# EAGLE design arducard (EAGLE 6.5.0)
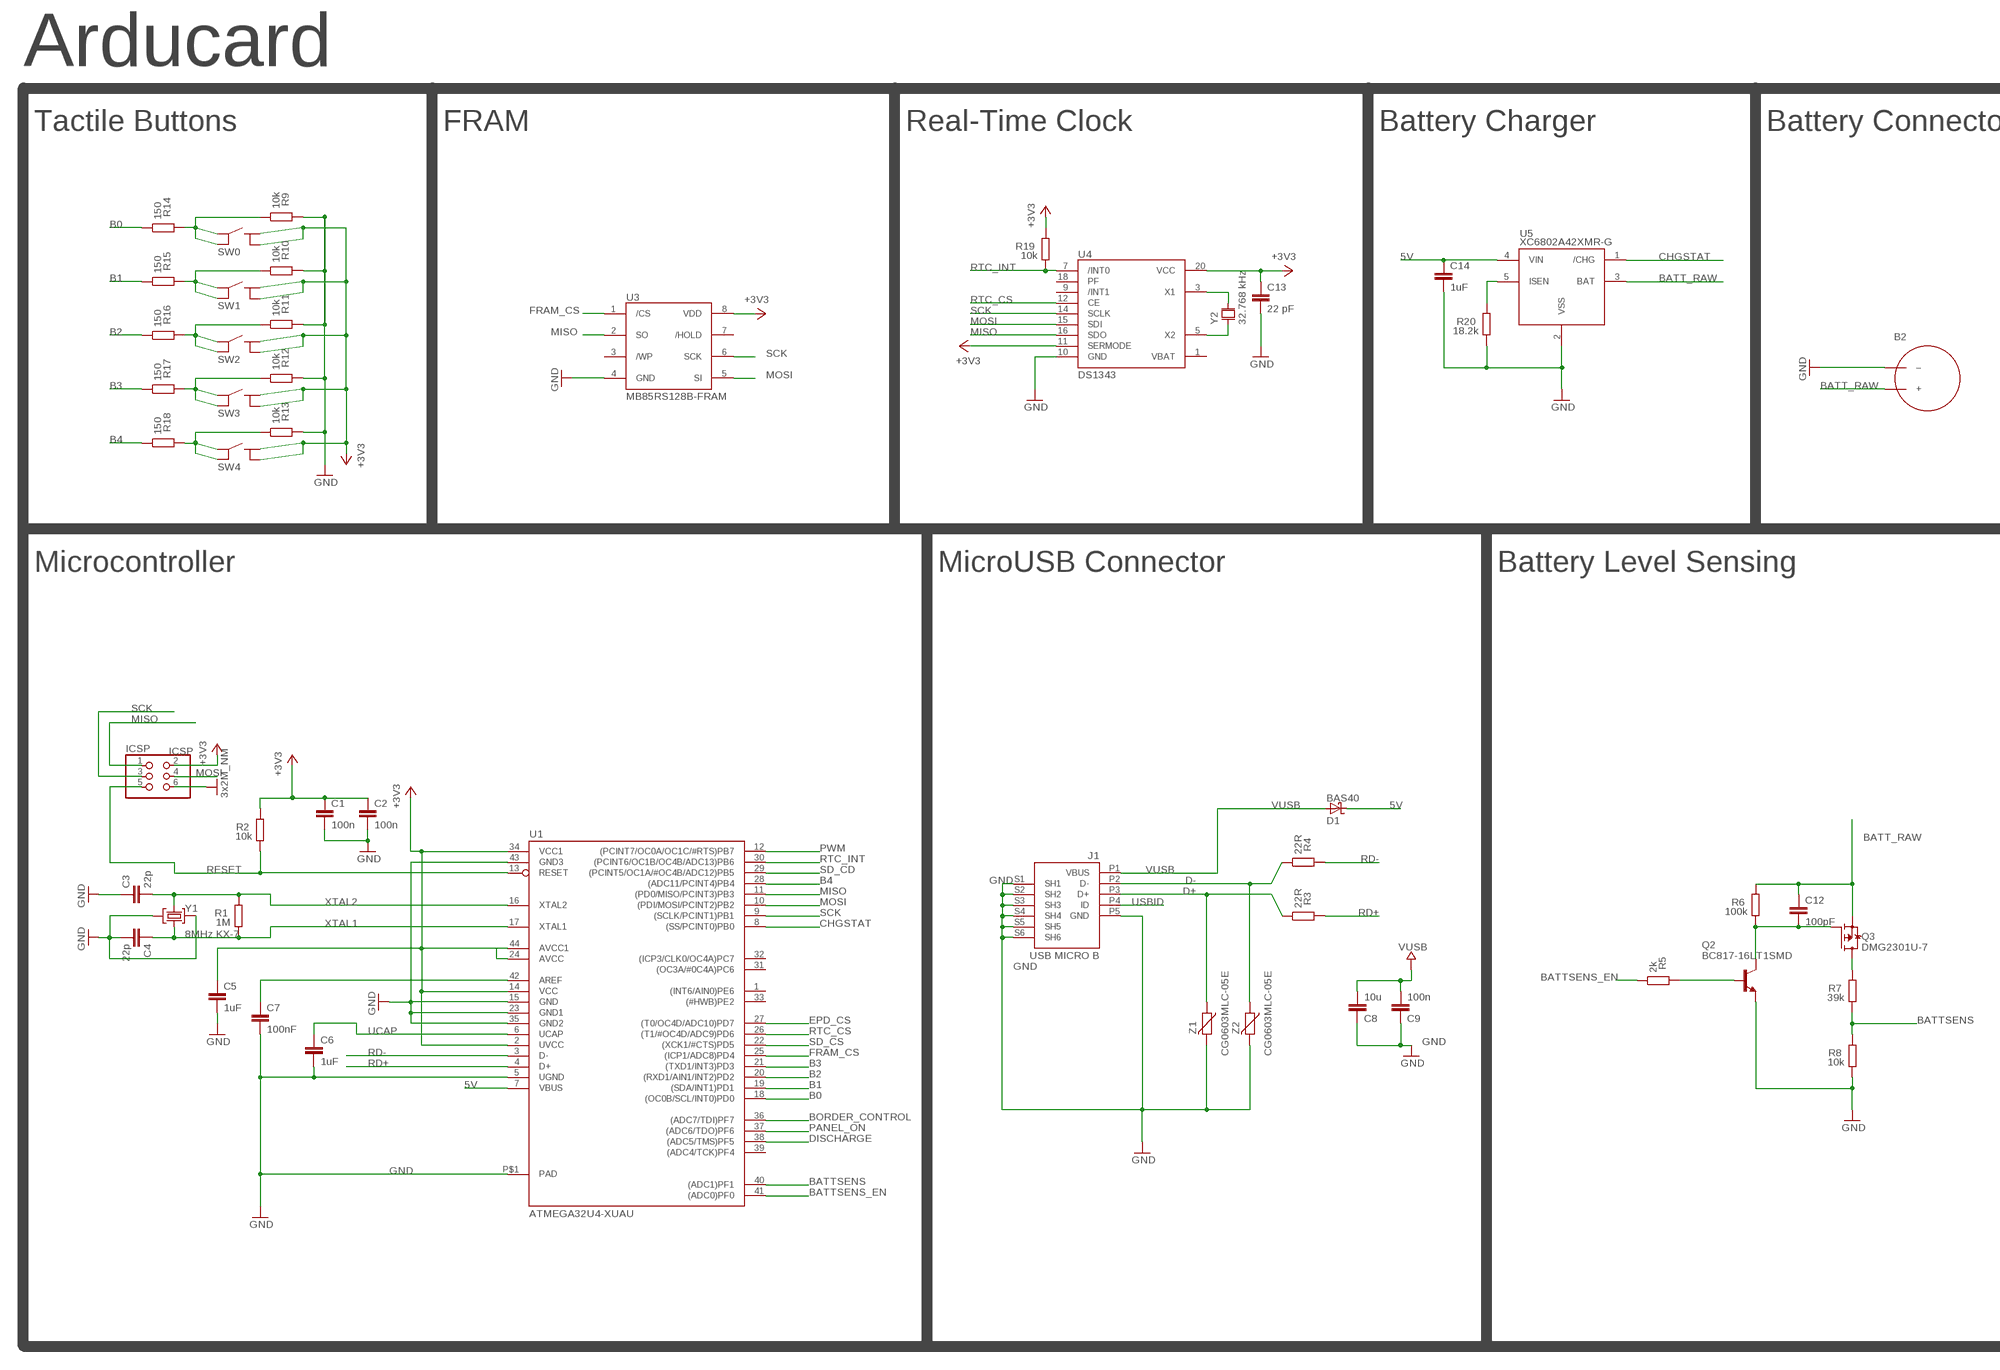
[diagram p0: schematic, sheet 1, part 1 of 2]
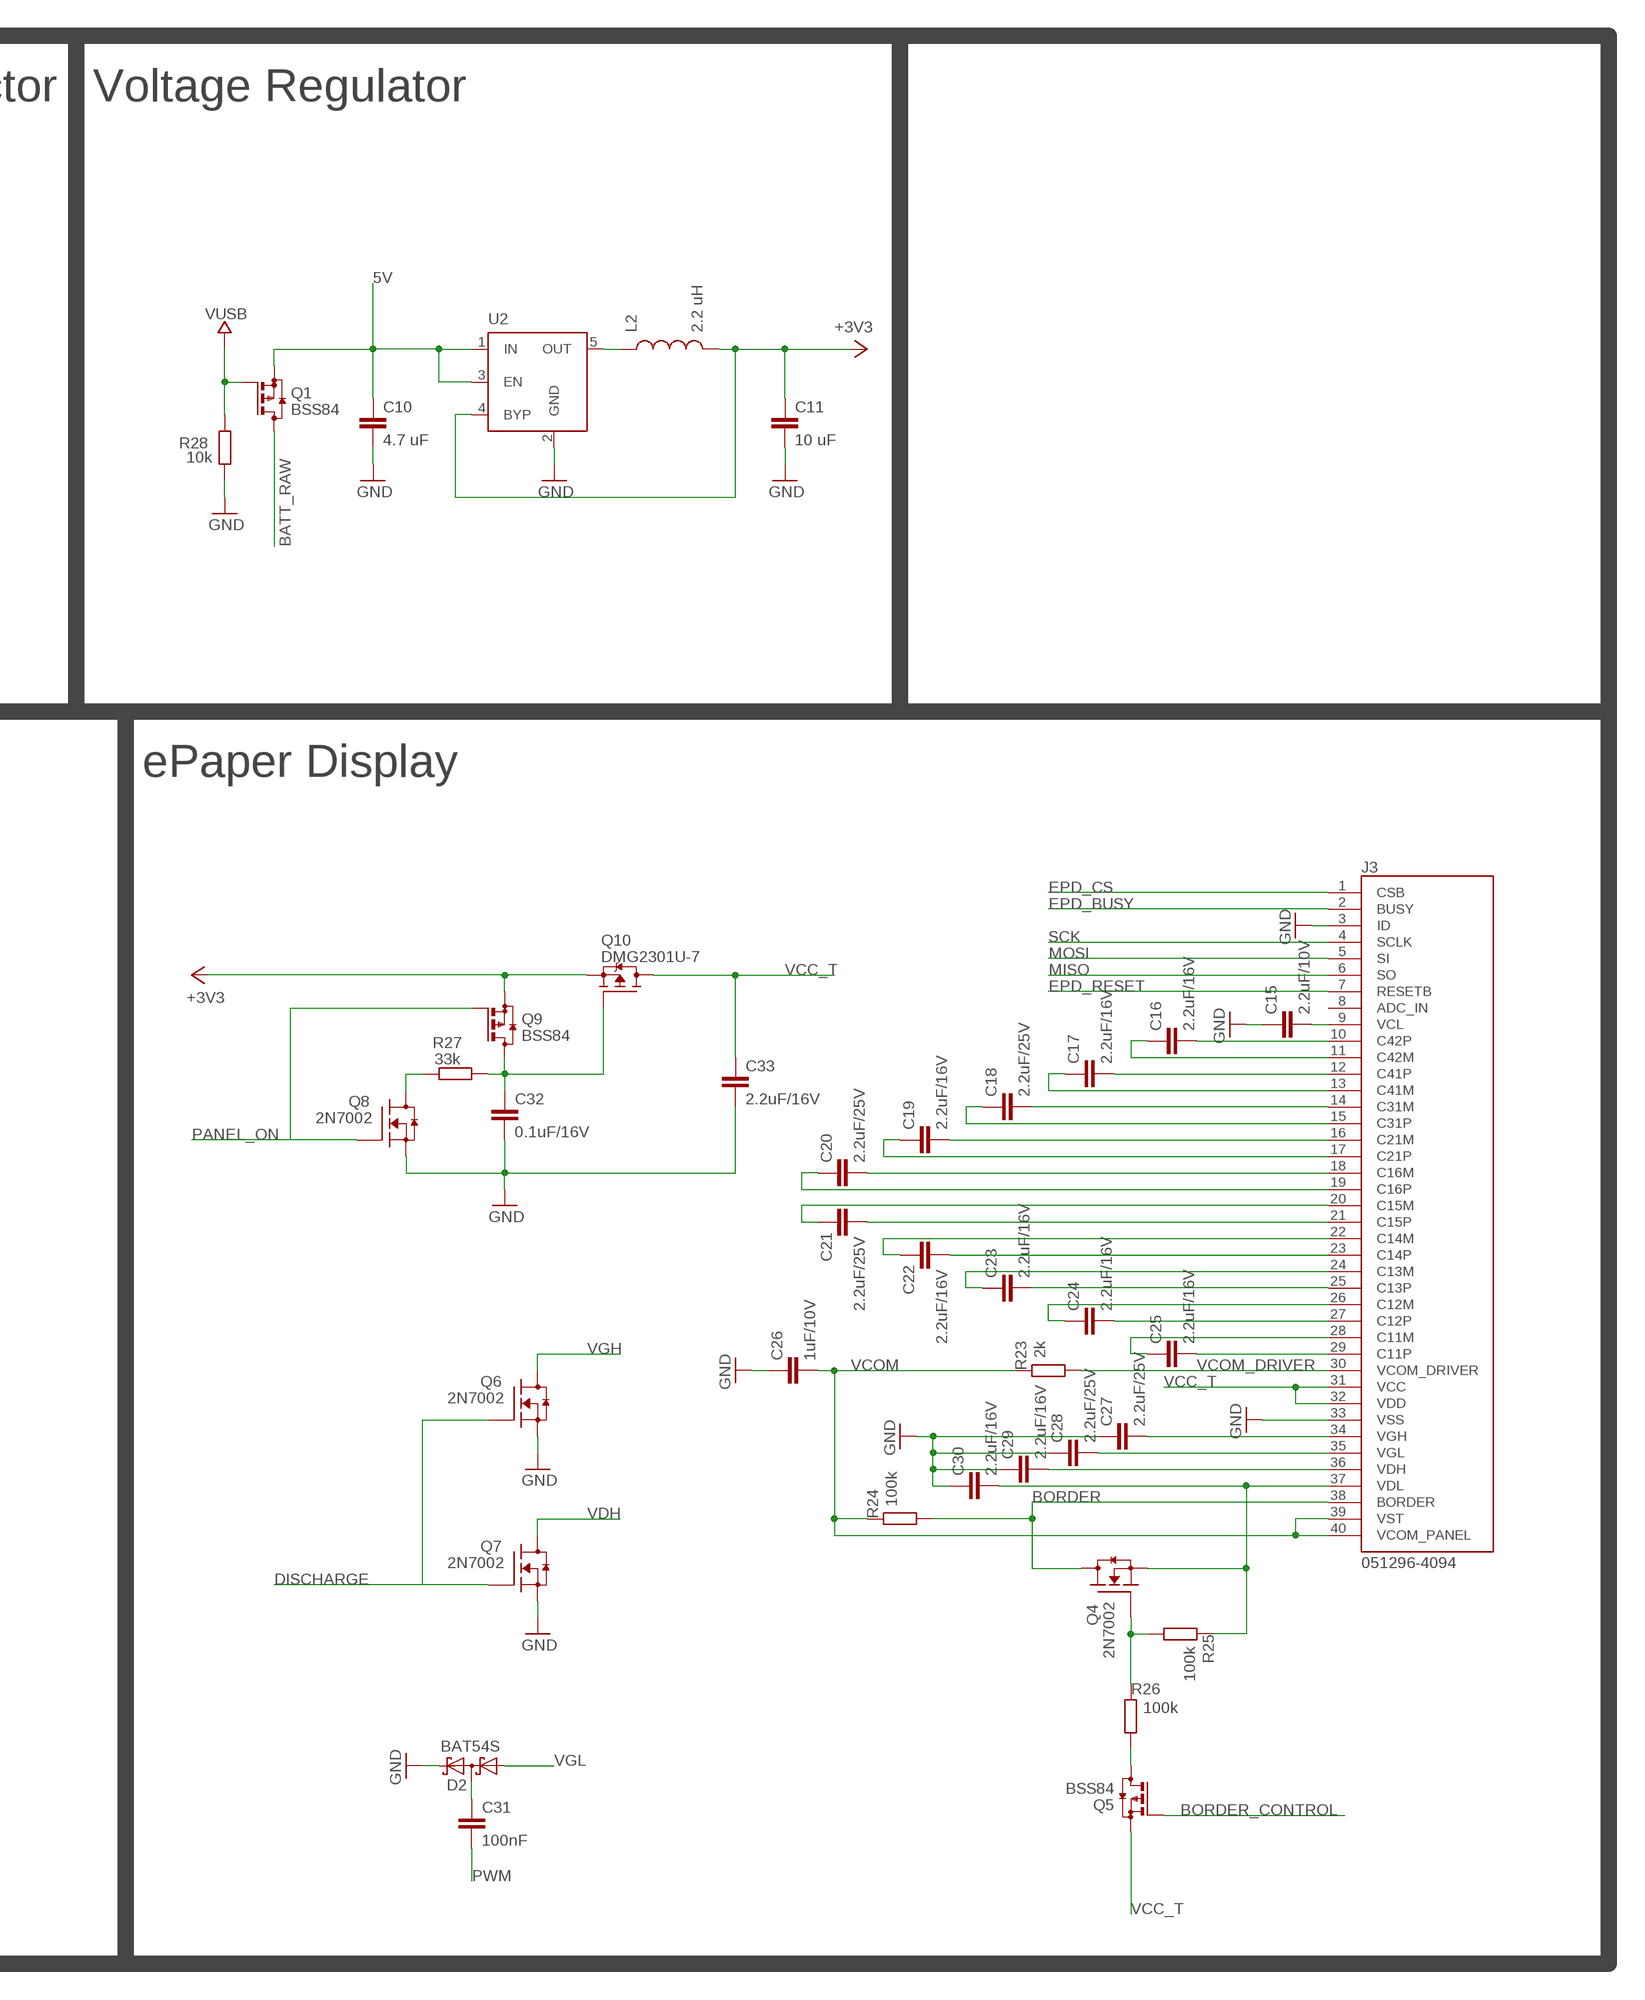
[diagram p1: schematic, sheet 1, part 2 of 2]

## Parts
B2  LIR2016  [BK-5067]
C1  100n  C-EUC0603  [C0603-ROUND]
C2  100n  C-EUC0603  [C0603-ROUND]
C3  22p  C-EUC0603  [C0603-ROUND]
C4  22p  C-EUC0603  [C0603-ROUND]
C5  1uF  C-EUC0603  [C0603-ROUND]
C6  1uF  C-EUC0603  [C0603-ROUND]
C7  100nF  C-EUC0603  [C0603-ROUND]
C8  10u  C-EUC0603  [C0603-ROUND]
C9  100n  C-EUC0603  [C0603-ROUND]
C10  4.7 uF  C-EUC0603  [C0603-ROUND]
C11  10 uF  C-EUC0603  [C0603-ROUND]
C12  100pF  C-EUC0603  [C0603-ROUND]
C13  22 pF  C-EUC0603  [C0603-ROUND]
C14  1uF  C-EUC0603  [C0603-ROUND]
C15  2.2uF/10V  C-EUC0603  [C0603-ROUND]
C16  2.2uF/16V  C-EUC0603  [C0603-ROUND]
C17  2.2uF/16V  C-EUC0603  [C0603-ROUND]
C18  2.2uF/25V  C-EUC0603  [C0603-ROUND]
C19  2.2uF/16V  C-EUC0603  [C0603-ROUND]
C20  2.2uF/25V  C-EUC0603  [C0603-ROUND]
C21  2.2uF/25V  C-EUC0603  [C0603-ROUND]
C22  2.2uF/16V  C-EUC0603  [C0603-ROUND]
C23  2.2uF/16V  C-EUC0603  [C0603-ROUND]
C24  2.2uF/16V  C-EUC0603  [C0603-ROUND]
C25  2.2uF/16V  C-EUC0603  [C0603-ROUND]
C26  1uF/10V  C-EUC0603  [C0603-ROUND]
C27  2.2uF/25V  C-EUC0603  [C0603-ROUND]
C28  2.2uF/25V  C-EUC0603  [C0603-ROUND]
C29  2.2uF/16V  C-EUC0603  [C0603-ROUND]
C30  2.2uF/16V  C-EUC0603  [C0603-ROUND]
C31  100nF  C-EUC0603  [C0603-ROUND]
C32  0.1uF/16V  C-EUC0603  [C0603-ROUND]
C33  2.2uF/16V  C-EUC0603  [C0603-ROUND]
D1  BAS40  [SOT23]
D2  BAT54S  [SOT23]
ICSP  ICSP  PINHD-2X3  [2X03]
J1  USB MICRO B  MYCON2_USB-MINI-B  [CON2_USB_MICRO_B_AT]
J3  051296-4094  [051296-4094]
L2  2.2 uH  INDUCTOR30OHM,1.8A  [0603]
Q1  BSS84  [SOT23]
Q2  BC817-16LT1SMD  [SOT23-BEC]
Q3  DMG2301U-7  [SOT23]
Q4  2N7002  [SOT-23]
Q5  BSS84  [SOT23]
Q6  2N7002  [SOT-23]
Q7  2N7002  [SOT-23]
Q8  2N7002  [SOT-23]
Q9  BSS84  [SOT23]
Q10  DMG2301U-7  [SOT23]
R1  1M  R-EU_R0603  [R0603-ROUND]
R2  10k  R-EU_R0603  [R0603-ROUND]
R3  22R  R-EU_R0603  [R0603-ROUND]
R4  22R  R-EU_R0603  [R0603-ROUND]
R5  2k  R-EU_R0603  [R0603-ROUND]
R6  100k  R-EU_R0603  [R0603-ROUND]
R7  39k  R-EU_R0603  [R0603-ROUND]
R8  10k  R-EU_R0603  [R0603-ROUND]
R9  10k  R-EU_R0603  [R0603-ROUND]
R10  10k  R-EU_R0603  [R0603-ROUND]
R11  10k  R-EU_R0603  [R0603-ROUND]
R12  10k  R-EU_R0603  [R0603-ROUND]
R13  10k  R-EU_R0603  [R0603-ROUND]
R14  150  R-EU_R0603  [R0603-ROUND]
R15  150  R-EU_R0603  [R0603-ROUND]
R16  150  R-EU_R0603  [R0603-ROUND]
R17  150  R-EU_R0603  [R0603-ROUND]
R18  150  R-EU_R0603  [R0603-ROUND]
R19  10k  R-EU_R0603  [R0603-ROUND]
R20  18.2k  R-EU_R0603  [R0603-ROUND]
R23  2k  R-EU_R0603  [R0603-ROUND]
R24  100k  R-EU_R0603  [R0603-ROUND]
R25  100k  R-EU_R0603  [R0603-ROUND]
R26  100k  R-EU_R0603  [R0603-ROUND]
R27  33k  R-EU_R0603  [R0603-ROUND]
R28  10k  R-EU_R0603  [R0603-ROUND]
SW0  EVQ-PUA  [SMD-TACT-SWITCH]
SW1  EVQ-PUA  [SMD-TACT-SWITCH]
SW2  EVQ-PUA  [SMD-TACT-SWITCH]
SW3  EVQ-PUA  [SMD-TACT-SWITCH]
SW4  EVQ-PUA  [SMD-TACT-SWITCH]
U1  ATMEGA32U4-XUAU  [TQFP44-PAD]
U2  MIC5219XX  [SOT23-5]
U3  MB85RS128B-FRAM  [SO-08]
U4  DS1343  [TSSOP20]
U5  XC6802A42XMR-G  [SOT23-5L]
Y1  8MHz KX-7  CRYSTAL-3.2-2.5  [CRYSTAL-3.2-2.5]
Y2  32.768 kHz  SSP-T7-F  [SSP-T7-F]
Z1  CG0603MLC-05E  VARISTORCN0603  [CT/CN0603]
Z2  CG0603MLC-05E  VARISTORCN0603  [CT/CN0603]

## Nets
5V: C10.1 C14.1 D1.3(C) Q1.2(S) U1.7(VBUS) U2.1(IN) U2.3(EN) U5.4(VIN)
+3V3: C1.1 C2.1 C5.1 C11.1 C13.1 ICSP.2 L2.2 Q9.2(S) Q10.2(S) R2.2 R19.2 SW0.2 SW0.4 SW1.2 SW1.4 SW2.2 SW2.4 SW3.2 SW3.4 SW4.2 SW4.4 U1.2(UVCC) U1.14(VCC) U1.24(AVCC) U1.34(VCC1) U1.44(AVCC1) U2.4(BYP) U3.8(VDD) U4.11(SERMODE) U4.20(VCC)
B0: R14.1 U1.18((OC0B/SCL/INT0)PD0)
B1: R15.1 U1.19((SDA/INT1)PD1)
B2: R16.1 U1.20((RXD1/AIN1/INT2)PD2)
B3: R17.1 U1.21((TXD1/INT3)PD3)
B4: R18.1 U1.28((ADC11/PCINT4)PB4)
BATT_RAW: B2.POS1(+) B2.POS2(+) C12.1 Q1.3(D) Q3.2(S) R6.2 U5.3(BAT)
BATTSENS: R7.1 R8.2 U1.40((ADC1)PF1)
BATTSENS_EN: R5.1 U1.41((ADC0)PF0)
BORDER: J3.38(BORDER) Q4.3(D) R24.2
BORDER_CONTROL: Q5.1(G) U1.36((ADC7/TDI)PF7)
CHGSTAT: U1.8((SS/PCINT0)PB0) U5.1(/CHG)
D+: J1.P3(D+) R3.1 Z1.1
D-: J1.P2(D-) R4.1 Z2.1
DISCHARGE: Q6.1(G) Q7.1(G) U1.38((ADC5/TMS)PF5)
EPD_BUSY: J3.2(BUSY)
EPD_CS: J3.1(CSB) U1.27((T0/OC4D/ADC10)PD7)
EPD_RESET: J3.7(RESETB)
FRAM_CS: U1.25((ICP1/ADC8)PD4) U3.1(/CS)
GND: B2.NEG(–) C1.2 C2.2 C3.1 C4.2 C5.2 C6.2 C7.2 C8.1 C9.1 C10.2 C11.2 C13.2 C14.2 C15.1 C26.1 C27.1 C28.1 C29.1 C30.1 C32.2 C33.2 D2.2(C2) ICSP.6 J1.P5(GND) J1.S1(SH1) J1.S2(SH2) J1.S3(SH3) J1.S4(SH4) J1.S5(SH5) J1.S6(SH6) J3.3(ID) J3.33(VSS) Q2.E Q6.2(S) Q7.2(S) Q8.2(S) R8.1 R9.2 R10.2 R11.2 R12.2 R13.2 R20.1 R28.1 U1.5(UGND) U1.15(GND) U1.23(GND1) U1.35(GND2) U1.43(GND3) U1.P$1(PAD) U2.2(GND) U3.4(GND) U4.10(GND) U5.2(VSS) Y1.2(GND) Y1.4(GND) Z1.2 Z2.2 ; supply symbol labelled 3x2M_NM
MISO: ICSP.1 J3.6(SO) U1.11((PD0/MISO/PCINT3)PB3) U3.2(SO) U4.16(SDO)
MOSI: ICSP.4 J3.5(SI) U1.10((PDI/MOSI/PCINT2)PB2) U3.5(SI) U4.15(SDI)
N$1: C15.2 J3.9(VCL)
N$2: R10.1 R15.2 SW1.1 SW1.3
N$3: R9.1 R14.2 SW0.1 SW0.3
N$4: U4.3(X1) Y2.P$4
N$5: R11.1 R16.2 SW2.1 SW2.3
N$6: R12.1 R17.2 SW3.1 SW3.3
N$7: L2.1 U2.5(OUT)
N$8: R13.1 R18.2 SW4.1 SW4.3
N$9: C7.1 U1.42(AREF)
N$11: C12.2 Q2.C Q3.1(G) R6.1
N$12: C16.2 J3.10(C42P)
N$13: Q3.3(D) R7.2
N$14: C16.1 J3.11(C42M)
N$15: C17.2 J3.12(C41P)
N$16: C17.1 J3.13(C41M)
N$17: U4.5(X2) Y2.P$1
N$18: C18.2 J3.14(C31M)
N$19: C18.1 J3.15(C31P)
N$20: C19.2 J3.16(C21M)
N$21: C19.1 J3.17(C21P)
N$22: C20.2 J3.18(C16M)
N$23: C20.1 J3.19(C16P)
N$24: C21.1 J3.20(C15M)
N$25: C21.2 J3.21(C15P)
N$26: C22.2 J3.23(C14P)
N$27: C22.1 J3.22(C14M)
N$28: C23.2 J3.25(C13P)
N$29: C23.1 J3.24(C13M)
N$30: C24.2 J3.27(C12P)
N$31: C24.1 J3.26(C12M)
N$32: C25.2 J3.29(C11P)
N$33: C25.1 J3.28(C11M)
N$34: Q8.3(D) R27.1
N$37: R20.2 U5.5(ISEN)
N$38: Q5.3(D) R26.2
N$39: Q4.1(G) R25.2 R26.1
N$40: C31.1 D2.3(C1A2)
N$44: C32.1 Q9.3(D) Q10.1(G) R27.2
PANEL_ON: Q8.1(G) Q9.1(G) U1.37((ADC6/TDO)PF6)
PWM: C31.2 U1.12((PCINT7/OC0A/OC1C/#RTS)PB7)
Q2: Q2.B R5.2
RD+: R3.2 U1.4(D+)
RD-: R4.2 U1.3(D-)
RESET: ICSP.5 R2.1 U1.13(RESET)
RTC_CS: U1.26((T1/#OC4D/ADC9)PD6) U4.12(CE)
RTC_INT: R19.1 U1.30((PCINT6/OC1B/OC4B/ADC13)PB6) U4.7(/INT0)
SCK: ICSP.3 J3.4(SCLK) U1.9((SCLK/PCINT1)PB1) U3.6(SCK) U4.14(SCLK)
SD_CD: U1.29((PCINT5/OC1A/#OC4B/ADC12)PB5)
SD_CS: U1.22((XCK1/#CTS)PD5)
UCAP: C6.1 U1.6(UCAP)
USBID: J1.P4(ID)
VCC_T: C33.1 J3.31(VCC) J3.32(VDD) Q5.2(S) Q10.3(D)
VCOM: C26.2 J3.39(VST) J3.40(VCOM_PANEL) R23.1 R24.1
VCOM_DRIVER: J3.30(VCOM_DRIVER) R23.2
VDH: C29.2 J3.36(VDH) Q7.3(D)
VDL: C30.2 J3.37(VDL) Q4.2(S) R25.1
VGH: C27.2 J3.34(VGH) Q6.3(D)
VGL: C28.2 D2.1(A1) J3.35(VGL)
VUSB [usbvcc]: C8.2 C9.2 D1.1(A) J1.P1(VBUS) Q1.1(G) R28.2
XTAL1: C4.1 R1.1 U1.17(XTAL1) Y1.1(C1)
XTAL2: C3.2 R1.2 U1.16(XTAL2) Y1.3(C2)
Unconnected: J3.8(ADC_IN) U1.1((INT6/AIN0)PE6) U1.31((OC3A/#0C4A)PC6) U1.32((ICP3/CLK0/OC4A)PC7) U1.33((#HWB)PE2) U1.39((ADC4/TCK)PF4) U3.3(/WP) U3.7(/HOLD) U4.1(VBAT) U4.9(/INT1) U4.18(PF)

## Notes on the sheet
- Arducard
- Tactile Buttons | FRAM | Real-Time Clock | Battery Charger | Battery Connector | Voltage Regulator
- Microcontroller | MicroUSB Connector | Battery Level Sensing | ePaper Display

## Library data of the parts
B2 = arducard-coincell:LIR2016
C1-C33 = SmartPrj:C-EU: CAPACITOR, European symbol
D1 = diode:BAS40: Silicon Schottky Diodes General-purpose diode for high-speed switching
D2 = diode:BAT54S: Schottky Diodes Pin connection corrected 2011-05-04 Source: Fairchild .. BAT54.pdf
ICSP = SmartPrj:PINHD-2X3: PIN HEADER
J1 = SmartPrj:MYCON2_USB-MINI-B
J3 = arducard-fpc:051296-4094
L2 = SparkFun-Passives:INDUCTOR: Inductors Basic Inductor/Choke - 0603 and 1206. Footprints are not proven and vary greatly between part numbers. SRN6045- 33uH, 20% 1.4A SDR0403-560KL - 56uH, 10%, 500mA RMS/740mA peak; PROD_ID: RES-07859
Q1 Q5 Q9 = transistor-small-signal:BSS84: P-CHANNEL MOS FET
Q2 = transistor-npn:BC817*: NPN Transistor
Q3 Q10 = transistor-fet:DMG2301U-7
Q4 Q6-Q8 = AWJLEagleLib:2N7002: 300 mA N-channel MOSFET
R1-R20 R23-R28 = SmartPrj:R-EU_: RESISTOR, European symbol
SW0 SW1-SW4 = arducard-switch:EVQ-PUA
U1 = SmartPrj:ATMEGA32U4-XU
U2 = v-reg-micrel:MIC5219XX: VOLTAGE REGULATOR; OC_FARNELL: unknown; OC_NEWARK: unknown
U3 = arducard-fram:MB85RS128B-FRAM
U4 = arducard-rtc:DS1343
U5 = arducard-xc6802:XC6802A42XMR-G
Y1 = SmartPrj:CRYSTAL-3.2-2.5
Y2 = arducard-rtc:SSP-T7-F
Z1 Z2 = varistor:VARISTOR: VARISTOR

## Net classes
0 default: width 0.254 mm, drill 0.61 mm, clearance 0.254 mm
2 gnd: width 0.254 mm, drill 0.61 mm, clearance 0.254 mm
3 usbvcc: width 0.254 mm, drill 0.61 mm, clearance 0.254 mm
4 aref: width 0.254 mm, drill 0.61 mm, clearance 0.254 mm

## Board
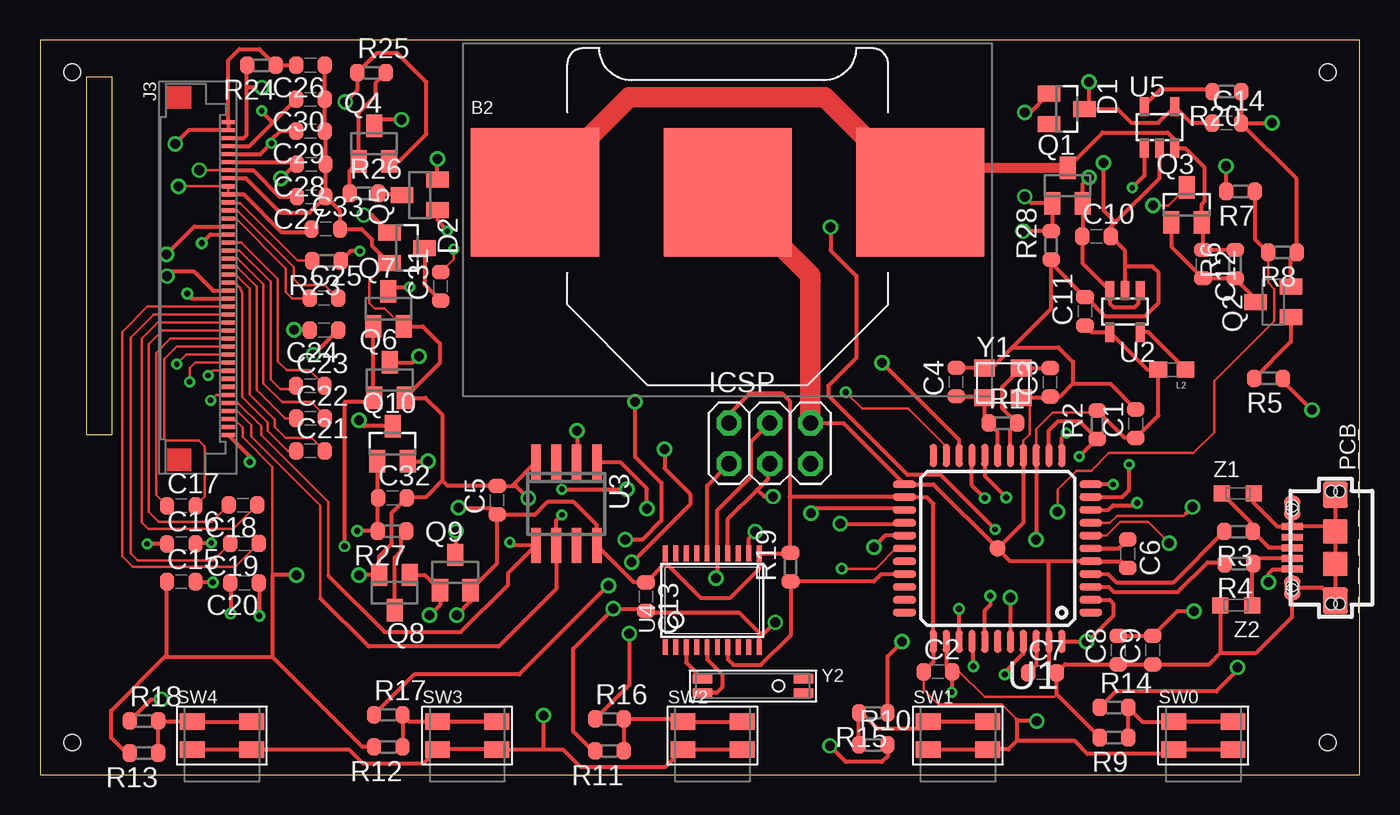
[diagram p2: board, top side]
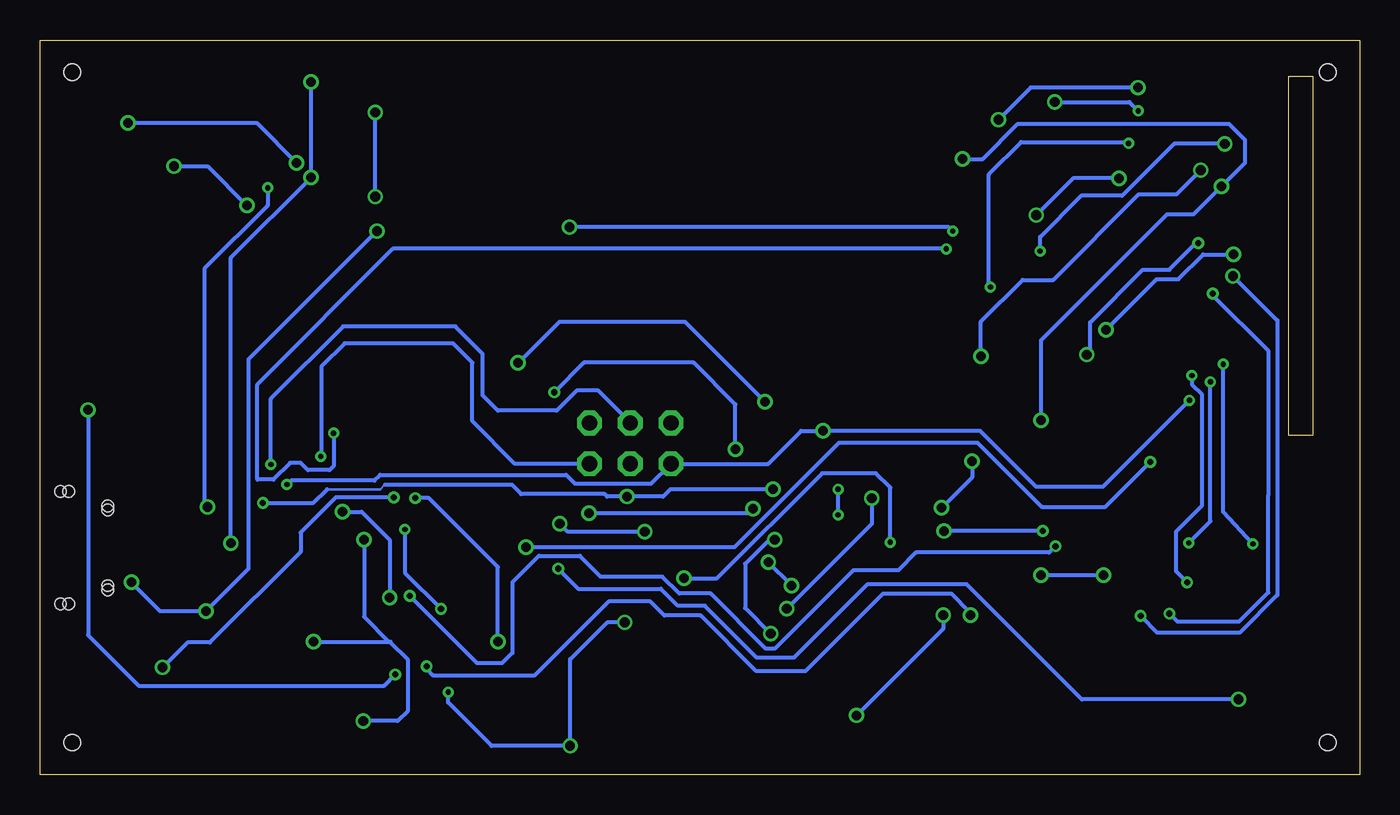
[diagram p3: board, bottom side, seen from below]

Size 82.26 x 45.8 mm. Coordinates in mm from the lower left corner, seen from the top.
Outline: 0,45.8 82.26,45.8 82.26,0 0,0 0,45.78
Outline: 4.47,21.19 4.47,43.52 2.9,43.52 2.9,21.18 4.47,21.18
Copper layers (1*16): Top 0.0356mm / dielectric 1.5011mm / Bottom 0.0356mm
Design rules "LaenPCBOrder": minimum track width 6mil, minimum drill 13mil, track to track 6mil, track to pad 6mil, pad to pad 6mil, via to via 6mil, smd to smd 6mil, copper to edge 15mil, drill to drill 6mil, minimum pad ring 7mil, minimum via ring 7mil, stop-mask expansion 3mil, vias tented up to drill 0mil, thermal gap 10mil
Holes 1 mm at 2,2 2,43.8 80.26,2 80.26,43.8

### Footprints (pad centres in the part's own frame; a part is rotated, then mirrored left to right if it is on the bottom)
BK-5067 = smd 8 x 8: NEG 0,0; POS1 -12,0; POS2 12,0
C0603-ROUND = smd 0.898 x 1.1: 1 -0.889,0; 2 0.889,0
SOT23 = smd 1 x 1.4: 1 -0.95,-1.1; 2 0.95,-1.1; 3 0,1.1
2X03 = drill 0.95 pad 1.55 octagon: 1 -2.54,-1.27; 2 -2.54,1.27; 3 0,-1.27; 4 0,1.27; 5 2.54,-1.27; 6 2.54,1.27
CON2_USB_MICRO_B_AT = smd 0.406 x 1.346: P1 -1.321,2.692; P2 -0.66,2.692; P3 0,2.692; P4 0.66,2.692; P5 1.321,2.692 | smd 1.651 x 1.549: S1 -3.302,0; S2 3.302,0 | smd 1.524 x 1.016: S3 -2.489,2.692; S4 2.489,2.692 | smd 1.524 x 1.524: S5 -1.016,0; S6 1.016,0 | hole 0.7: -3.505,0.254; -3.505,-0.254; 3.505,0.254; 3.505,-0.254; -2.616,2.692; -2.362,2.692; 2.362,2.692; 2.616,2.692
051296-4094 = smd 0.254 x 0.8: 1 21.75,3.8; 2 21.25,3.8; 3 20.75,3.8; 4 20.25,3.8; 5 19.75,3.8; 6 19.25,3.8; 7 18.75,3.8; 8 18.25,3.8; 9 17.75,3.8; 10 17.25,3.8; 11 16.75,3.8; 12 16.25,3.8; 13 15.75,3.8; 14 15.25,3.8; 15 14.75,3.8; 16 14.25,3.8; 17 13.75,3.8; 18 13.25,3.8; 19 12.75,3.8; 20 12.25,3.8; 21 11.75,3.8; 22 11.25,3.8; 23 10.75,3.8; 24 10.25,3.8; 25 9.75,3.8; 26 9.25,3.8; 27 8.75,3.8; 28 8.25,3.8; 29 7.75,3.8; 30 7.25,3.8; 31 6.75,3.8; 32 6.25,3.8; 33 5.75,3.8; 34 5.25,3.8; 35 4.75,3.8; 36 4.25,3.8; 37 3.75,3.8; 38 3.25,3.8; 39 2.75,3.8; 40 2.25,3.8
0603 = smd 1.1 x 1: 1 -0.85,0; 2 0.85,0
SOT23-BEC = smd 1 x 1.4: B -0.95,-1.1; C 0,1.1; E 0.95,-1.1
SOT-23 = smd 1 x 1.4: 1 -0.95,-1.1; 2 0.95,-1.1; 3 0,1.1
R0603-ROUND = smd 0.898 x 1.1: 1 -0.889,0; 2 0.889,0
SMD-TACT-SWITCH = smd 1.55 x 1.025: 1 1.85,0.863; 2 1.85,-0.863; 3 -1.85,0.863; 4 -1.85,-0.863
TQFP44-PAD = smd 1.4 x 0.45: 1 -5.8,4; 2 -5.8,3.2; 3 -5.8,2.4; 4 -5.8,1.6; 5 -5.8,0.8; 6 -5.8,0; 7 -5.8,-0.8; 8 -5.8,-1.6; 9 -5.8,-2.4; 10 -5.8,-3.2; 11 -5.8,-4; 23 5.8,-4; 24 5.8,-3.2; 25 5.8,-2.4; 26 5.8,-1.6; 27 5.8,-0.8; 28 5.8,0; 29 5.8,0.8; 30 5.8,1.6; 31 5.8,2.4; 32 5.8,3.2; 33 5.8,4 | smd 0.45 x 1.4: 12 -4,-5.8; 13 -3.2,-5.8; 14 -2.4,-5.8; 15 -1.6,-5.8; 16 -0.8,-5.8; 17 0,-5.8; 18 0.8,-5.8; 19 1.6,-5.8; 20 2.4,-5.8; 21 3.2,-5.8; 22 4,-5.8; 34 4,5.8; 35 3.2,5.8; 36 2.4,5.8; 37 1.6,5.8; 38 0.8,5.8; 39 0,5.8; 40 -0.8,5.8; 41 -1.6,5.8; 42 -2.4,5.8; 43 -3.2,5.8; 44 -4,5.8 | smd 1 x 1: P$1 0,0
SOT23-5 = smd 0.55 x 1.2: 1 -0.95,-1.3; 2 0,-1.3; 3 0.95,-1.3; 4 0.95,1.3; 5 -0.95,1.3
SO-08 = smd 0.6 x 2.2: 1 -1.905,-2.6; 2 -0.635,-2.6; 3 0.635,-2.6; 4 1.905,-2.6; 5 1.905,2.6; 6 0.635,2.6; 7 -0.635,2.6; 8 -1.905,2.6
TSSOP20 = smd 0.305 x 0.991: 1 -2.925,-2.918; 2 -2.275,-2.918; 3 -1.625,-2.918; 4 -0.975,-2.918; 5 -0.325,-2.918; 6 0.325,-2.918; 7 0.975,-2.918; 8 1.625,-2.918; 9 2.275,-2.918; 10 2.925,-2.918; 11 2.925,2.918; 12 2.275,2.918; 13 1.625,2.918; 14 0.975,2.918; 15 0.325,2.918; 16 -0.325,2.918; 17 -0.975,2.918; 18 -1.625,2.918; 19 -2.275,2.918; 20 -2.925,2.918
SOT23-5L = smd 0.55 x 1.2: 1 -0.95,-1.3; 2 0,-1.3; 3 0.95,-1.3; 4 0.95,1.3; 5 -0.95,1.3
CRYSTAL-3.2-2.5 = smd 1.3 x 1.05: 1 -1.15,-0.925; 2 1.15,-0.925; 3 1.15,0.925; 4 -1.15,0.925
SSP-T7-F = smd 1.2 x 0.6: P$1 0,0; P$2 6.3,0; P$3 6.3,0.9; P$4 0,0.9
CT/CN0603 = smd 1 x 1: 1 -1,0; 2 1,0

### Placement (x,y rotation side)
B2  42.85,36.3 0 top
C1  68.29,21.88 90 top
C2  55.96,6.41 0 top
C3  62.95,24.48 90 top
C4  57.09,24.48 90 top
C5  28.49,17.12 90 top
C6  67.78,13.77 270 top
C7  62.47,6.35 0 top
C8  67.2,7.77 90 top
C9  69.35,7.77 90 top
C10  65.85,33.56 0 top
C11  65.12,28.88 90 top
C12  72.48,31.84 270 top
C13  37.77,11.1 270 top
C14  73.95,40.62 0 top
C15  8.8,12.03 0 top
C16  8.8,14.38 0 top
C17  8.8,16.76 0 top
C18  12.64,16.81 180 top
C19  12.73,14.41 180 top
C20  12.73,11.96 180 top
C21  16.85,20.19 0 top
C22  16.85,22.22 0 top
C23  16.84,24.25 0 top
C24  17.7,27.72 180 top
C25  17.69,29.71 0 top
C26  16.86,44.24 180 top
C27  16.9,36.04 180 top
C28  16.9,38.06 180 top
C29  16.85,40.13 180 top
C30  16.85,42.12 180 top
C31  24.97,30.45 90 top
C32  21.96,17.25 0 top
C33  17.8,34.02 0 top
D1  63.98,41.51 270 top
D2  22.87,32.84 270 top
ICSP  45.48,20.65 0 top
J1  80.73,14.14 90 top
J3  7.93,42.93 270 top
L2  70.54,25.25 180 top
Q1  64.04,36.72 0 top
Q2  76.86,29.47 90 top
Q3  71.46,35.52 0 top
Q4  20.82,39.34 0 top
Q5  23.66,36.14 90 top
Q6  21.79,24.6 0 top
Q7  21.71,29.05 0 top
Q8  22.09,11.35 180 top
Q9  25.87,12.6 0 top
Q10  21.97,20.63 0 top
R1  60,21.92 0 top
R2  65.89,21.82 90 top
R3  74.7,15.15 180 top
R4  74.72,13.15 180 top
R5  76.57,24.71 180 top
R6  74.48,31.84 90 top
R7  74.82,36.37 180 top
R8  77.42,32.57 180 top
R9  66.93,2.31 180 top
R10  51.93,1.85 0 top
R11  35.49,1.47 180 top
R12  21.7,1.73 180 top
R13  6.47,1.34 180 top
R14  66.93,4.18 0 top
R15  51.93,3.85 180 top
R16  35.49,3.47 0 top
R17  21.7,3.73 0 top
R18  6.47,3.34 0 top
R19  46.77,12.92 90 top
R20  73.96,42.59 180 top
R23  17.85,32.04 180 top
R24  13.79,44.23 180 top
R25  20.65,43.77 0 top
R26  20.19,36.25 0 top
R27  21.94,15.18 180 top
R28  63.01,33 90 top
SW0  72.5,2.43 0 top
SW1  57.21,2.43 0 top
SW2  41.92,2.43 0 top
SW3  26.62,2.43 0 top
SW4  11.34,2.43 0 top
U1  59.68,14.1 180 top
U2  67.62,28.88 180 top
U3  32.8,16.89 180 top
U4  41.89,10.87 0 top
U5  69.77,40.36 0 top
Y1  60.01,24.43 0 top
Y2  41.28,5.08 0 top
Z1  74.64,17.53 0 top
Z2  74.56,10.56 180 top

### Tracks (layer width: path | path; a pad name or v marks a point on that pad's centre or on a via)
5V  (via drill 0.6)
  Top 0.152: U1.7 66.48,14.9 67.32,15.74 69.07,15.74 v70.37,14.44
  Top 0.254: C14.1 71.76,40.62 U5.4 69.7,40.64 68.02,40.64 67.15,41.51 D1.3 65.37,41.8 v65.37,43.19 | U2.1 68.57,29.79 68.47,29.69 68.47,29.39 68.22,29.14 66.92,29.14 66.67,29.39 U2.3 64.96,31.89 C10.1 64.99,33.59 Q1.2 64.99,36.86 v65.37,37.24
  Bottom 0.254: v65.37,43.19 v65.37,37.24 70.37,32.24 v70.37,14.44
+3V3  (via drill 0.6)
  Top 0.152: C2.1 55.07,5.29 55.97,4.39 59.92,4.39 60.87,3.44 | U1.14 62.08,21.55 63.12,22.59 65.77,22.59
  Top 0.254: Q10.2 v24.16,19.53 v24.17,19.54 | v26.07,16.64 28.08,16.64 C5.1 | C5.1 28.49,13.17 Q9.2 26.82,10.79 v25.97,9.94 | 28.58,16.14 C5.1 | ICSP.2 42.94,22.45 44.27,23.79 46.22,23.79 46.72,23.29 46.72,17.34 | 46.72,17.34 46.72,13.87 R19.2 46.75,13.79 U4.11 44.82,12.84 42.97,10.99 41.22,10.99 38.97,13.24 U4.20 38.97,13.19 C13.1 37.01,11.99 U3.8 34.71,15.55 33.27,16.99 31.62,16.99 30.82,16.19 28.53,16.19 C5.1 | 46.72,17.34 46.76,17.3 U1.24 53.89,17.29 55.27,17.29 55.68,16.88 U1.34 55.68,7.01 C2.1 | SW4.4 SW4.2 19.24,1.57 20.12,0.69 23.9,0.69 SW3.4 SW3.2 31.37,1.57 | 31.37,1.57 32.59,1.57 33.67,0.49 38.99,0.49 SW2.4 SW2.2 | v31.37,3.69 31.37,1.57 | C11.1 65.53,27.58 U2.4 69.01,25.25 L2.2 | L2.2 69.51,25.25 | SW1.4 SW1.2 60.35,1.57 60.87,2.09 | 60.87,2.09 60.87,3.44 60.97,3.34 v62.12,3.34 | SW0.2 SW0.4 70.37,1.29 65.27,1.29 64.47,2.09 60.87,2.09 | U1.2 66.66,10.9 66.87,10.69 66.87,9.89 65.28,8.3 U1.44 65.21,8.3 v65.22,8.29 | 65.77,22.59 R2.2 67.6,20.99 C1.1 69.69,22.39 L2.2 | U1.14 v62.08,14.65 v62.07,14.64
  Bottom 0.254: v24.17,19.54 24.17,18.54 v26.07,16.64 | v25.97,9.94 25.97,9.09 v31.37,3.69 | v65.22,8.29 60.52,8.29 | 60.52,8.29 60.42,8.29 60.42,8.24 59.32,7.14 59.32,3.99 59.97,3.34 v62.12,3.34 | v62.07,14.64 62.07,9.84 60.52,8.29
B0  (via drill 0.38, 0.6)
  Top 0.254: U1.18 58.88,18.63 v60.22,17.29 | v74.62,6.69 74.62,6.49 73.32,5.19 67.05,5.19 R14.1
  Bottom 0.254: v60.22,17.29 63.82,17.29 66.02,15.09 66.02,13.89 71.67,8.24 73.07,8.24 v74.62,6.69
B1  (via drill 0.38, 0.6)
  Top 0.254: R15.1 52.81,7.38 v53.72,8.29 | U1.19 58.08,18.03 v58.87,17.24
  Bottom 0.254: v53.72,8.29 53.72,12.94 58.02,17.24 v58.87,17.24
B2  (via drill 0.6)
  Top 0.254: U1.20 57.28,20.88 v52.47,25.69 | v37.07,23.24 37.07,19.84 38.72,18.19 38.72,15.84 37.52,14.64 v36.47,14.64 | v36.72,8.79 36.72,5.59 R16.1
  Bottom 0.254: v52.47,25.69 52.42,25.69 49.87,28.24 42.07,28.24 v37.07,23.24 | v36.47,14.64 36.82,14.64 38.32,13.14 38.32,10.39 v36.72,8.79
B3  (via drill 0.38, 0.6)
  Top 0.152: U1.21 56.48,20.46 54.12,22.82 51.24,22.82 v50.22,23.84
  Top 0.254: v38.92,20.29 38.92,19.09 40.52,17.49 40.52,16.84 36.92,13.24 v36.87,13.24 | v35.42,11.79 29.87,6.24 23.32,6.24 R17.1
  Bottom 0.254: v38.92,20.29 38.92,23.09 41.52,25.69 48.37,25.69 v50.22,23.84 | v35.42,11.79 v36.87,13.24
B4  (via drill 0.38, 0.6)
  Top 0.152: v49.97,12.84 52.07,12.84 53.33,14.1
  Top 0.254: U1.28 53.33,14.1 | R18.1 6.92,4.69 v7.57,4.69
  Bottom 0.254: v49.97,12.84 48.72,11.59 43.57,11.59 42.5,10.52 40.82,10.52 37.59,7.29 35.27,7.29 30.67,11.89 24.52,11.89 17.32,4.69 v7.57,4.69
BATT_RAW
  Top 0.254: R6.2 C12.1 72.48,34.36 Q3.2 72.41,35.58 72.58,35.75 72.58,37.84 71.39,39.03 70.75,39.03 U5.3 70.72,39.59 70.27,40.04 66.22,40.04 64.04,37.86 Q1.3
  Top 0.61: Q1.3 56.38,37.82 B2.POS2
  Top 1.27: B2.POS1 30.86,36.38 36.72,42.24 48.91,42.24 B2.POS2
BATTSENS  (via drill 0.6)
  Top 0.152: R8.2 76.54,30.67 76.92,30.29 76.92,28.29 73.17,24.54 73.17,21.34 71.87,20.04 66.62,20.04 65.52,18.94 64.57,18.94 63.42,17.79 v63.42,16.39
  Top 0.254: R7.1 75.71,33.4 R8.2 | v60.47,11.04 60.47,8.31 U1.40
  Bottom 0.254: v63.42,16.39 62.22,16.39 60.47,14.64 v60.47,11.04
BATTSENS_EN  (via drill 0.38, 0.6)
  Top 0.254: R5.1 77.45,24.55 v79.27,22.74 | v60.12,6.24 60.12,6.39 61.28,7.55 U1.41
  Bottom 0.254: v79.27,22.74 79.27,8.69 76.12,5.54 60.82,5.54 v60.12,6.24
BORDER  (via drill 0.6)
  Top 0.254: J3.38 12.66,39.68 12.87,39.89 12.87,42.87 | 12.87,42.87 12.87,44.2 R24.2 12.9,43.76 | v22.52,40.84 21.22,40.84 Q4.3 | v13.82,42.84 12.9,42.84 12.87,42.87
  Bottom 0.254: v13.82,42.84 20.52,42.84 v22.52,40.84
BORDER_CONTROL  (via drill 0.33, 0.38, 0.6)
  Top 0.254: U1.36 v57.28,10.33 v57.27,10.34 | Q5.1 24.76,34.6 v25.37,33.89 | v49.27,34.14 49.27,32.69 50.87,31.09 50.87,25.99 49.12,24.24 49.12,23.63 54.04,18.71 56.1,18.71 v59.52,15.29
  Bottom 0.254: v59.52,15.29 59.52,12.59 v57.27,10.34 | v25.37,33.89 25.62,34.14 v49.27,34.14
CHGSTAT  (via drill 0.33, 0.6)
  Top 0.152: 65.49,15.69 66.67,15.69 67.12,16.14 71.27,16.14 v71.82,16.69
  Top 0.254: U5.1 68.82,37.34 v68.07,36.59 | 65.49,15.69 U1.8 | 71.42,16.29 v71.82,16.69
  Bottom 0.254: v68.07,36.59 68.07,35.49 72.02,31.54 72.02,16.89 v71.82,16.69
D+
  Top 0.254: J1.P3 76.6,14.14 R3.1 75.48,15.27 75.48,15.69 Z1.1
D-
  Top 0.254: J1.P2 75.79,13.48 R4.1 75.56,13.06 Z2.1
DISCHARGE  (via drill 0.38)
  Top 0.254: Q7.1 20.76,23.58 Q6.1 20.58,23.24 19.02,23.24 18.97,23.19 v18.97,14.24 | v59.22,11.14 59.22,10.59 58.88,10.25 U1.38
  Bottom 0.254: v18.97,14.24 19.37,13.84 27.67,13.84 28.77,12.74 31.57,12.74 36.47,7.84 37.02,7.84 40.47,11.29 42.42,11.29 43.47,12.34 47.32,12.34 48.62,13.64 51.17,13.64 52.82,11.99 52.82,7.59 53.47,6.94 55.02,6.94 v59.22,11.14
EPD_CS  (via drill 0.38, 0.6)
  Top 0.254: J3.1 13.07,19.84 v13.07,19.49 | U1.27 52.68,14.9 v51.97,14.19
  Bottom 0.254: v13.07,19.49 15.87,16.69 19.82,16.69 23.82,20.69 32.47,20.69 38.97,14.19 v51.97,14.19
FRAM_CS  (via drill 0.6)
  Top 0.254: U3.1 36.17,19.49 37.82,17.84 v37.82,16.59 | U1.25 53.79,16.59 48.33,16.59 v48.05,16.31
  Bottom 0.254: v48.05,16.31 38.1,16.31 v37.82,16.59
GND  (via drill 0.33, 0.6)
  Top 0.152: J3.3 12.08,22.18 12.62,21.64 12.62,21.04 14.47,19.19 14.47,12.44 | 21.62,31.89 20.52,30.79 20.52,29.41 20.87,29.06 21.47,29.06 22.58,27.95 Q7.2 | C2.2 57.3,6.41 58.87,4.84 63.2,4.84 63.36,5 | 61.27,19.91 61.27,20.82 61.67,21.22 61.67,22.99 Y1.2
  Top 0.254: C15.1 7.86,11.98 7.86,7.42 7.78,7.34 | 7.78,7.34 14.47,7.34 | 14.47,12.44 14.47,7.34 | C27.1 18.69,35.14 C33.2 20.04,34.02 20.67,33.39 20.67,32.99 D2.2 21.62,31.89 | C27.1 C28.1 17.79,40.09 C29.1 C30.1 C26.1 | J3.33 12.83,37.18 14.97,35.04 16.79,35.04 C27.1 | Q7.2 23.86,27.95 24.92,26.89 24.92,25.68 Q6.2 24.01,23.5 25.07,22.44 25.07,18.34 | 14.48,12.45 14.47,12.44 | 25.07,18.34 24.02,17.29 22.89,17.29 C32.2 21.92,16.32 21.92,14.39 21.14,13.62 Q8.2 19.88,12.45 v19.87,12.44 | 25.07,18.34 25.4,18.01 C5.2 29.42,18.01 | 29.42,18.01 U3.4 | v15.97,12.44 14.47,12.44 | 29.42,18.01 29.65,18.01 v30.42,17.24 | U4.10 44.82,8.84 | 44.82,8.84 43.57,10.09 37.88,10.09 C13.2 37.63,10.34 v35.72,10.34 33.22,7.84 33.22,2.69 34.44,1.47 R11.2 | ICSP.6 50.06,21.92 U1.23 55.68,18.1 U1.P$1 | R13.2 5.37,1.34 4.42,2.29 4.42,3.98 7.78,7.34 | R12.2 20.09,1.73 14.47,7.34 | R20.1 74.85,40.63 | 74.85,40.63 C14.2 78.31,37.15 R8.1 77.96,32.22 Q2.E | U2.2 67.62,31.74 | 67.62,31.74 67.62,32.68 C10.2 66.74,34.16 67.02,34.44 | 67.02,34.44 69.77,37.19 U5.2 | 78.04,16.85 J1.S4 J1.P5 | J1.S2 J1.S6 | J1.S6 J1.S5 J1.S1 79.92,11.65 J1.S3 78.04,9.83 75.8,7.59 73.56,7.59 | J1.S6 80.43,15.46 J1.P5 | 67.62,31.74 67.67,31.69 69.32,31.69 69.72,31.29 69.72,29.44 68.87,28.59 66.37,28.59 65.19,29.77 C11.2 63.01,31.88 R28.1 63.01,29.05 60.6,26.64 | 74.85,40.63 v76.76,40.63 v76.77,40.64 | v66.27,38.14 66.27,35.19 67.02,34.44 | C6.2 67.36,13.3 U1.5 62.92,13.3 | U1.35 56.48,6.78 C2.2 56.85,5.17 v56.82,5.14 | C7.2 62.88,6.83 U1.43 62.88,13.26 62.92,13.3 | R10.2 52.81,1.14 52.47,0.79 50.22,0.79 v49.22,1.79 | C7.2 63.89,6.88 C8.1 C9.1 72.85,6.88 73.56,7.59
  Top 0.254: R9.2 63.36,5 C7.2 | 62.92,13.3 60.48,13.3 U1.P$1 | U1.P$1 61.28,15.7 U1.15 61.27,19.91 | C4.2 57.11,25.35 Y1.4 59.31,25.35 60.6,26.64 | Y1.2 62.87,23.5 C3.1 63.58,23.59 64.37,24.38 | 60.6,26.64 63.47,26.64 64.37,25.74 64.37,24.38 | 64.37,24.38 66.69,24.38 C1.2 | Z2.2 73.56,7.59 | 44.82,8.84 45.17,8.84 v45.82,9.49 | Z1.2 75.64,16.94 77.12,15.46 J1.P5
  Top 0.61: 48.36,30.79 47.87,31.29
  Top 1.27: ICSP.6 48.02,31.14 47.87,31.29 B2.NEG
  Bottom 0.254: v19.87,12.44 v15.97,12.44 | v30.42,17.24 30.42,15.64 v35.72,10.34 | v76.77,40.64 68.77,40.64 v66.27,38.14 | v56.82,5.14 56.82,4.49 54.12,1.79 v49.22,1.79 49.22,7.19 46.92,9.49 v45.82,9.49
MISO  (via drill 0.33, 0.6)
  Top 0.152: J3.6 10.96,23.68 v10.62,23.34
  Top 0.254: v33.47,21.44 33.47,19.52 U3.2 | U4.16 41.57,18.01 ICSP.1 | v66.87,18.09 65.49,18.09 U1.11
  Bottom 0.254: v66.87,18.09 66.62,18.34 61.42,18.34 61.07,18.69 49.47,18.69 48.92,18.14 44.18,18.14 ICSP.1 36.88,19.38 34.82,21.44 v33.47,21.44 23.67,21.44 20.17,17.94 16.02,17.94 v10.62,23.34
MOSI  (via drill 0.33, 0.6)
  Top 0.152: J3.5 12.33,23.18 13.77,21.74 13.77,21.19 17.97,16.99 17.97,12.39
  Top 0.254: v29.27,14.49 29.47,14.29 U3.5 29.17,12.56 29.17,11.84 26.22,8.89 21.47,8.89 17.97,12.39 | v42.12,12.24 42.22,12.34 U4.15 42.22,16.49 44.32,18.59 44.32,20.77 ICSP.4 | U1.10 67.43,17.3 67.87,17.74 v67.87,19.34
  Bottom 0.254: v29.27,14.49 29.27,17.89 30.17,18.79 33.52,18.79 40.07,12.24 v42.12,12.24 | ICSP.4 45.48,21.95 47.47,23.94 48.82,23.94 50.07,22.69 53.72,22.69 54.67,23.64 54.67,26.24 56.37,27.94 63.37,27.94 67.87,23.44 v67.87,19.34
N$1  (via drill 0.33, 0.38)
  Top 0.152: J3.9 10.77,25.19 v10.47,24.89
  Top 0.254: J3.9 | v10.77,11.99 9.72,11.99 C15.2
  Bottom 0.254: v10.77,11.99 11.47,12.69 11.47,15.14 9.87,16.74 9.87,23.74 10.47,24.34 v10.47,24.89
N$2
  Top 0.254: SW1.1 SW1.3 54.94,2.87 52.19,2.87 51.21,3.85 R15.2 R10.1
N$3
  Top 0.254: R9.1 R14.2 68.71,3.3 SW0.3 SW0.1
N$4
  Top 0.254: U4.3 40.27,6.99 Y2.P$4
N$5
  Top 0.254: R11.1 R16.2 39.27,3.47 SW2.3 SW2.1
N$6
  Top 0.254: R12.1 R17.2 23.03,3.29 SW3.3 SW3.1
N$7
  Top 0.254: L2.1 69.06,27.58 U2.5
N$8
  Top 0.254: SW4.1 SW4.3 7.4,3.3 R18.2 R13.1
N$9
  Top 0.254: U1.42 62.08,6.85 C7.1
N$11
  Top 0.254: Q3.1 70.51,32.91 C12.2 R6.1 75.76,29.67 Q2.C
N$12  (via drill 0.33)
  Top 0.152: J3.10 9.67,25.69 9.32,25.34 v9.32,24.49
  Top 0.254: C16.2 9.74,14.44 v10.67,14.44 | J3.10
  Bottom 0.254: v10.67,14.44 9.32,15.79 v9.32,24.49
N$13  (via drill 0.6)
  Top 0.152: v69.37,35.49 70.33,35.49 Q3.3
  Top 0.254: R7.2 v73.93,37.93 v73.92,37.94
  Bottom 0.254: v73.92,37.94 71.82,37.94 v69.37,35.49
N$14  (via drill 0.33)
  Top 0.152: J3.11 9.11,26.18 v8.52,25.59
  Top 0.254: C16.1 v6.67,14.39
  Bottom 0.254: v8.52,25.59 8.52,16.39 v6.67,14.39
N$15
  Top 0.152: C17.2 10.27,17.34 10.27,20.45 9.89,20.83 7.86,20.83 7.73,20.96 7.73,25.91 8.5,26.68 J3.12
N$16
  Top 0.152: C17.1 7.22,17.44 7.22,26.29 8.11,27.18 J3.13
N$17
  Top 0.254: U4.5 41.57,7.19 42.52,6.24 42.52,5.44 42.17,5.09 Y2.P$1
N$18
  Top 0.152: C18.2 10.69,15.75 7.4,15.75 6.77,16.38 6.77,26.86 7.6,27.68 J3.14
N$19
  Top 0.152: J3.15 7.34,28.18 6.35,27.2 6.35,15.71 6.75,15.31 12.02,15.31 C18.1
N$20
  Top 0.152: J3.16 7.07,28.68 5.65,27.26 5.65,13.78 6.08,13.35 10.79,13.35 C19.2
N$21
  Top 0.152: J3.17 6.68,29.18 5.11,27.61 5.11,13.61 5.78,12.94 12.16,12.94 C19.1
N$22  (via drill 0.38)
  Top 0.254: C20.2 11.87,11.94 v11.87,10.04 | v9.17,29.99 9.48,29.68 J3.18
  Bottom 0.254: v11.87,10.04 11.37,9.54 7.52,9.54 5.7,11.36 5.7,17.44 5.69,17.45 5.69,26.4 9.17,29.88 v9.17,29.99
N$23  (via drill 0.38, 0.6)
  Top 0.254: C20.1 13.67,11.92 v13.67,9.89 | v7.92,31.09 8.22,31.39 9.57,31.39 10.78,30.18 J3.19
  Bottom 0.254: v13.67,9.89 12.62,8.84 7.5,8.84 5.15,11.19 5.15,28.32 v7.92,31.09
N$24
  Top 0.152: C21.1 15.42,20.19 14.18,21.43 14.18,21.97 12.61,23.54 12.61,29.8 arc100 J3.20
N$25
  Top 0.152: J3.21 12.2,31.18 13.08,30.3 13.08,23.69 14.63,22.14 14.63,21.69 15.32,21 16.93,21 C21.2
N$26
  Top 0.152: J3.23 12.33,32.18 13.92,30.59 13.92,24.39 15.09,23.22 16.89,23.22 17.74,22.37 C22.2
N$27
  Top 0.152: C22.1 15.27,22.22 13.5,23.99 13.5,30.44 12.26,31.68 J3.22
N$28
  Top 0.152: J3.25 12.53,33.18 14.82,30.89 14.82,25.76 15.36,25.22 16.76,25.22 C23.2
N$29
  Top 0.152: 15.74,24.04 14.97,24.04 14.37,24.64 14.37,30.74 12.43,32.68 J3.24
  Top 0.254: C23.1 15.74,24.04
N$30  (via drill 0.6)
  Top 0.254: C24.2 16.8,27.74 v15.82,27.74 | v7.87,32.44 9.61,34.18 J3.27
  Bottom 0.254: v15.82,27.74 12.67,30.89 11.32,30.89 9.77,32.44 v7.87,32.44
N$31  (via drill 0.38, 0.6)
  Top 0.254: C24.1 17.06,26.19 v17.02,26.19 | v10.07,33.14 10.61,33.68 J3.26
  Bottom 0.254: v17.02,26.19 16.82,26.39 16.82,28.19 13.52,31.49 11.87,31.49 10.22,33.14 v10.07,33.14
N$32
  Top 0.152: C25.2 17.75,30.54 16.17,30.54 15.82,30.89 15.82,31.64 12.28,35.18 J3.29
N$33
  Top 0.152: 16.78,29.69 15.72,29.69 15.32,30.09 15.32,31.57 12.21,34.68 12.08,34.68 J3.28
  Top 0.254: C25.1 16.78,29.69
N$34
  Top 0.254: Q8.3 22.09,13.52 22.52,13.94 22.52,14.87 R27.1
N$37
  Top 0.254: U5.5 68.82,41.71 69.85,42.74 72.92,42.74 R20.2
N$38
  Top 0.254: R26.2 21.36,36.25 21.42,36.19 22.51,36.19 Q5.3
N$39
  Top 0.254: R26.1 19.3,37.67 Q4.1 19.87,41.29 20.92,42.34 20.92,43.15 R25.2
N$40
  Top 0.254: D2.3 23.97,30.56 C31.1
N$44  (via drill 0.38, 0.6)
  Top 0.254: Q10.1 21.02,17.3 C32.1 21.05,17.23 R27.2 v19.78,15.18 v19.77,15.19 | v25.92,15.19 25.92,13.74 Q9.3
  Bottom 0.254: v19.77,15.19 v25.92,15.19
PANEL_ON  (via drill 0.38, 0.6)
  Top 0.254: Q8.1 23.97,12.45 Q9.1 24.92,10.59 v24.27,9.94 | v58.17,6.74 58.17,8.21 U1.37
  Bottom 0.254: v24.27,9.94 24.27,10.09 25.47,11.29 29.72,11.29 34.57,6.44 37.61,6.44 41.09,9.92 43.35,9.92 44.22,10.79 46.82,10.79 51.42,6.19 57.77,6.19 58.17,6.59 v58.17,6.74
PWM  (via drill 0.33)
  Top 0.152: C31.2 25.78,32.15 v25.78,32.78
  Top 0.254: U1.12 63.68,21 v63.97,21.29
  Bottom 0.254: v63.97,21.29 63.97,19.24 64.22,18.99 65.57,18.99 66.02,19.44 66.67,19.44 67.72,18.39 68.72,18.39 68.72,24.34 60.27,32.79 v25.79,32.79 v25.78,32.78
Q2
  Top 0.254: Q2.B 77.96,26.99 R5.2
RD+
  Top 0.254: U1.4 66.56,12.5 67.07,11.99 70.65,11.99 R3.2
RD-
  Top 0.254: U1.3 66.61,11.7 66.92,11.39 70.92,11.39 72.77,13.24 73.6,13.24 R4.2
RESET  (via drill 0.33)
  Top 0.254: U1.13 62.88,21.45 63.47,22.04 64.78,22.04 R2.1 65.92,20.9 65.83,20.9 v64.77,19.84
  Bottom 0.254: ICSP.5 52.66,19.38 55.32,22.04 55.32,25.69 56.52,26.89 63.27,26.89 64.72,25.44 64.72,19.89 v64.77,19.84
RTC_CS  (via drill 0.6)
  Top 0.254: U4.12 44.17,14.74 v44.57,15.14 | 53.77,15.59 U1.26 53.82,15.64 v49.87,15.64
  Bottom 0.254: v44.57,15.14 49.37,15.14 v49.87,15.64
RTC_INT
  Top 0.254: U4.7 42.87,7.19 43.22,6.84 44.92,6.84 46.77,8.69 R19.1 51.97,12.04 52.42,12.49 53.87,12.49 U1.30
SCK  (via drill 0.33, 0.38, 0.6)
  Top 0.152: 17.47,10.99 17.47,16.79 13.17,21.09 13.17,21.79 12.27,22.69 J3.4
  Top 0.254: U4.14 42.87,15.94 44.7,17.77 | 44.7,17.77 45.37,18.44 45.37,19.28 ICSP.3 | 17.47,10.99 20.47,7.99 28.57,7.99 32.17,11.59 U3.6 32.17,15.84 v32.52,16.19 | U1.9 66.58,16.5 66.87,16.79 68.22,16.79 v68.37,16.94 | v32.52,17.79 v36.57,17.79 | v45.67,17.34 45.12,17.34 44.7,17.77
  Bottom 0.152: 64.37,17.79 61.07,17.79 60.77,18.09
  Bottom 0.254: v68.37,16.94 65.22,16.94 64.37,17.79 | 60.77,18.09 52.87,18.09 52.27,17.49 47.07,17.49 46.92,17.34 v45.67,17.34 43.42,17.34 42.97,17.79 v36.57,17.79 | v32.52,16.19 v32.52,17.79
UCAP
  Top 0.254: U1.6 67.22,14.1 C6.1
VCC_T  (via drill 0.6)
  Top 0.152: J3.31 J3.32 | v8.62,36.69 J3.32
  Top 0.254: J3.31 12.68,36.18 15.02,33.84 16.73,33.84 C33.1 | Q5.2 v24.76,38.38 v24.77,38.39 | J3.32 | Q10.3 20.23,21.73 v19.87,22.09
  Bottom 0.254: v24.77,38.39 23.52,38.39 21.32,40.59 8.17,40.59 7.17,39.59 7.17,38.14 v8.62,36.69 10.37,34.94 12.02,34.94 19.87,27.09 v19.87,22.09
VCOM  (via drill 0.33, 0.6)
  Top 0.254: C26.2 15.96,44.23 R24.1 13.67,45.24 12.42,45.24 11.73,44.55 J3.40 J3.39 9.26,40.18 v8.42,39.34 | v19.93,32.64 19.33,32.64 R23.1
  Bottom 0.254: v8.42,39.34 11.57,39.34 14.82,36.09 17.37,36.09 19.93,33.53 v19.93,32.64
VCOM_DRIVER
  Top 0.152: R23.2 16.07,32.04 12.47,35.64 11.77,35.64 J3.30
VDH  (via drill 0.33)
  Top 0.254: C29.2 14.96,40.13 14.42,39.59 v14.42,39.37 13.73,38.68 J3.36 | Q7.3 21.96,30.4 v23.03,30.4
  Bottom 0.254: v14.42,39.37 14.49,39.44 21.12,39.44 23.12,37.44 23.12,30.49 v23.03,30.4
VDL  (via drill 0.33, 0.6)
  Top 0.254: J3.37 13.03,39.18 14.5,40.66 | 14.5,40.66 C30.2 | v19.02,41.94 19.76,42.68 R25.1 20.98,44.99 22.27,44.99 24.07,43.19 24.07,39.94 22.37,38.24 Q4.2 | v13.82,41.39 13.82,41.34 14.5,40.66
  Bottom 0.254: v19.02,41.94 14.37,41.94 v13.82,41.39
VGH  (via drill 0.6)
  Top 0.152: J3.34 v9.92,37.69
  Top 0.254: J3.34 13.28,37.68 14.92,36.04 C27.2 | Q6.3 23.23,25.7 v23.62,26.09
  Bottom 0.254: v23.62,26.09 23.62,28.24 21.02,30.84 19.12,30.84 13.77,36.19 11.42,36.19 v9.92,37.69
VGL  (via drill 0.6)
  Top 0.254: J3.35 15.89,38.18 C28.2 15.89,38.06 v15.02,37.19 | v20.17,34.89 20.67,34.89 D2.1
  Bottom 0.254: v15.02,37.19 17.87,37.19 v20.17,34.89
VUSB  (via drill 0.6)
  Top 0.254: v61.37,36.04 61.79,35.62 Q1.1 63.09,33.97 R28.2 v61.27,33.89 | v61.37,41.29 61.71,41.29 D1.1 | C8.2 C9.2 70.88,10.19 v71.92,10.19 | v76.57,11.99 76.57,12.54 76.82,12.79 78.01,12.79 J1.P1
  Bottom 0.254: v61.37,36.04 v61.37,41.29 | v61.27,33.89 69.27,25.89 69.27,12.84 v71.92,10.19 74.77,10.19 v76.57,11.99
XTAL1
  Top 0.254: C4.1 58.77,23.59 Y1.1 58.86,22.18 R1.1 59.68,21.35 U1.17
XTAL2
  Top 0.254: C3.2 62.94,25.35 Y1.3 59.97,24.16 59.97,22.84 R1.2 60.48,21.51 U1.16